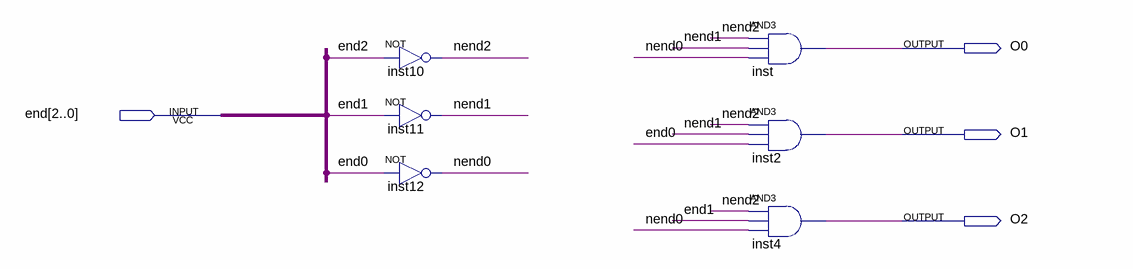
[diagram p0: schematic sheet]
// Quartus schematic decodificador2(1).bdf as structural Verilog: 6 symbols, 4 pins
module \decodificador2(1)  (
  input  [2:0] \end ,
  output O0,
  output O1,
  output O2
);

  wire nend0, nend1, nend2;

  not inst10 (nend2, \end [2]);
  not inst11 (nend1, \end [1]);
  not inst12 (nend0, \end [0]);
  and inst (O0, nend2, nend1, nend0);
  and inst2 (O1, nend2, nend1, \end [0]);
  and inst4 (O2, nend2, \end [1], nend0);
endmodule
